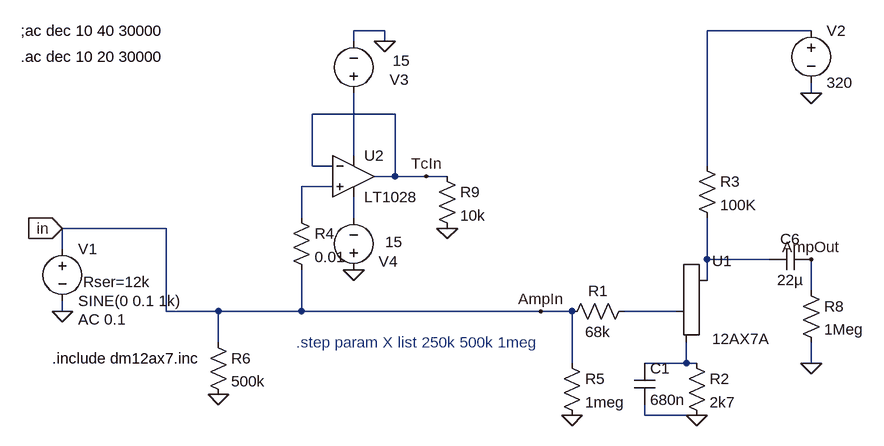
[diagram p0: schematic EMU-1-1-Follower_as_input.asc]
EMU-1-1-Follower_as_input.asc, the LTspice schematic file:
Version 4
SHEET 1 880 680
WIRE -32 0 -80 0
WIRE 624 0 464 0
WIRE -80 16 -80 0
WIRE -32 16 -32 0
WIRE 624 96 624 80
WIRE -16 128 -144 128
WIRE -80 192 -80 96
WIRE -144 208 -144 128
WIRE -112 208 -144 208
WIRE 464 208 464 0
WIRE -16 224 -16 128
WIRE -16 224 -48 224
WIRE 32 224 -16 224
WIRE 64 224 32 224
WIRE -112 240 -160 240
WIRE -160 288 -160 240
WIRE -80 288 -80 256
WIRE -368 304 -528 304
WIRE -528 336 -528 304
WIRE 464 352 464 288
WIRE 560 352 464 352
WIRE 464 384 464 352
WIRE 624 400 624 352
WIRE -528 432 -528 416
WIRE -368 432 -368 304
WIRE -288 432 -368 432
WIRE -160 432 -160 368
WIRE -160 432 -288 432
WIRE 208 432 -160 432
WIRE 256 432 208 432
WIRE 416 432 336 432
WIRE -288 480 -288 432
WIRE 256 512 256 432
WIRE 432 512 432 480
WIRE 432 512 368 512
WIRE 448 512 432 512
WIRE 624 512 624 480
WIRE 368 592 368 576
WIRE 448 592 368 592
FLAG -528 432 0
FLAG 448 592 0
FLAG -528 304 in
IOPIN -528 304 In
FLAG 256 592 0
FLAG 624 96 0
FLAG 624 512 0
FLAG 64 304 0
FLAG 208 432 AmpIn
FLAG 32 224 TcIn
FLAG -80 368 0
FLAG -32 16 0
FLAG 624 352 AmpOut
FLAG -288 560 0
SYMBOL Misc\\triode 464 432 R0
SYMATTR InstName U1
SYMATTR Value 12AX7A
SYMATTR SpiceModel 12AX7A
SYMBOL voltage -528 320 R0
WINDOW 123 24 124 Left 2
WINDOW 39 32 67 Left 2
SYMATTR Value2 AC 0.1
SYMATTR SpiceLine Rser=12k
SYMATTR InstName V1
SYMATTR Value SINE(0 0.1 1k)
SYMBOL res 352 416 R90
WINDOW 0 0 56 VBottom 2
WINDOW 3 32 56 VTop 2
SYMATTR InstName R1
SYMATTR Value 68k
SYMBOL res 432 496 R0
SYMATTR InstName R2
SYMATTR Value 2k7
SYMBOL cap 352 512 R0
SYMATTR InstName C1
SYMATTR Value 680n
SYMBOL voltage 624 -16 R0
WINDOW 123 0 0 Left 2
WINDOW 39 0 0 Left 2
SYMATTR InstName V2
SYMATTR Value 320
SYMBOL res 448 192 R0
SYMATTR InstName R3
SYMATTR Value 100K
SYMBOL res 240 496 R0
SYMATTR InstName R5
SYMATTR Value 1meg
SYMBOL res 608 384 R0
SYMATTR InstName R8
SYMATTR Value 1Meg
SYMBOL cap 624 336 R90
WINDOW 0 0 32 VBottom 2
WINDOW 3 32 32 VTop 2
SYMATTR InstName C6
SYMATTR Value 22µ
SYMBOL Opamps\\LT1028 -80 160 R0
SYMATTR InstName U2
SYMBOL res -176 272 R0
SYMATTR InstName R4
SYMATTR Value 0.01
SYMBOL res 48 208 R0
SYMATTR InstName R9
SYMATTR Value 10k
SYMBOL voltage -80 112 R180
WINDOW 123 0 0 Left 2
WINDOW 39 0 0 Left 2
WINDOW 0 -85 37 Left 2
WINDOW 3 -87 66 Left 2
SYMATTR InstName V3
SYMATTR Value 15
SYMBOL voltage -80 384 R180
WINDOW 123 0 0 Left 2
WINDOW 39 0 0 Left 2
WINDOW 0 -68 29 Left 2
WINDOW 3 -76 59 Left 2
SYMATTR InstName V4
SYMATTR Value 15
SYMBOL res -304 464 R0
SYMATTR InstName R6
SYMATTR Value 500k
TEXT -544 504 Left 2 !.include dm12ax7.inc
TEXT -592 0 Left 2 !;ac dec 10 40 30000
TEXT -168 480 Left 2 ;.step param X list 250k 500k 1meg
TEXT -592 40 Left 2 !.ac dec 10 20 30000

The netlist it stands for:
* EMU-1-1-Follower_as_input.asc
XU1 N005 N006 N007 12AX7A 12AX7A
V1 AmpIn 0 SINE(0 0.1 1k) AC 0.1 Rser=12k
R1 N006 AmpIn 68k
R2 N007 0 2k7
C1 N007 0 680n
V2 N001 0 320
R3 N001 N005 100K
R5 AmpIn 0 1meg
R8 AmpOut 0 1Meg
C6 AmpOut N005 22µ
XU2 N003 TcIn N002 N004 TcIn LT1028  ; pins In+ In- V+ V- OUT
R4 N003 AmpIn 0.01
R9 TcIn 0 10k
V3 N002 0 15
V4 0 N004 15
R6 AmpIn 0 500k
.include dm12ax7.inc
;ac dec 10 40 30000
* .step param X list 250k 500k 1meg
.ac dec 10 20 30000
.lib LTC.lib
.backanno
.end